# Altium schematic sheet AVR Board 4.0 Ports.SchDoc
size A
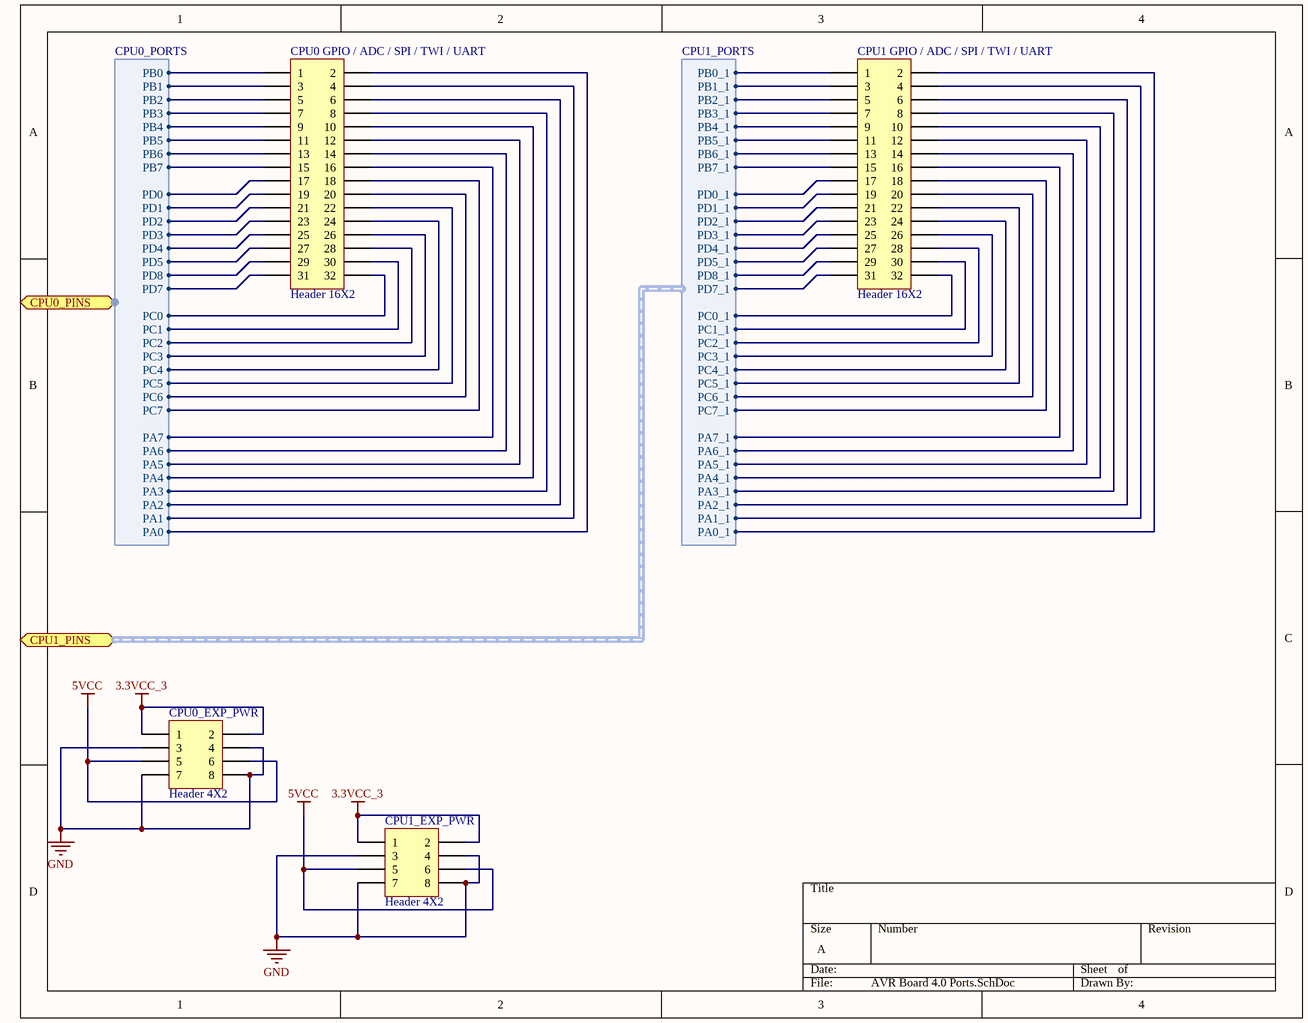
[diagram p0: AVR Board 4.0 Ports.SchDoc]

## Parts
CPU0_EXP_PWR  Header 4X2  [HDR2X4]
CPU0_GPIO_/_ADC_/_SPI_/_TWI_/_UART  Header 16X2  [HDR2X16]
CPU1_EXP_PWR  Header 4X2  [HDR2X4]
CPU1_GPIO_/_ADC_/_SPI_/_TWI_/_UART  Header 16X2  [HDR2X16]

## Ports
CPU0_PINS (harness CPU0_PORTS), CPU1_PINS (harness CPU1_PORTS)

## Harnesses
CPU0_PORTS: PA0, PA1, PA2, PA3, PA4, PA5, PA6, PA7, PC0, PC1, PC2, PC3, PC4, PC5, PC6, PC7, PD7, PD8, PD5, PD4, PD3, PD2, PD1, PD0, PB7, PB6, PB5, PB4, PB3, PB2, PB1, PB0
CPU1_PORTS: PA0_1, PA1_1, PA2_1, PA3_1, PA4_1, PA5_1, PA6_1, PA7_1, PC0_1, PC1_1, PC2_1, PC3_1, PC4_1, PC5_1, PC6_1, PC7_1, PD7_1, PD8_1, PD5_1, PD4_1, PD3_1, PD2_1, PD1_1, PD0_1, PB7_1, PB6_1, PB5_1, PB4_1, PB3_1, PB2_1, PB1_1, PB0_1

## Nets
3.3VCC_3: CPU0_EXP_PWR.1 CPU0_EXP_PWR.2 CPU1_EXP_PWR.1 CPU1_EXP_PWR.2
5VCC: CPU0_EXP_PWR.5 CPU0_EXP_PWR.6 CPU1_EXP_PWR.5 CPU1_EXP_PWR.6
GND: CPU0_EXP_PWR.3 CPU0_EXP_PWR.4 CPU0_EXP_PWR.7 CPU0_EXP_PWR.8 CPU1_EXP_PWR.3 CPU1_EXP_PWR.4 CPU1_EXP_PWR.7 CPU1_EXP_PWR.8
NetCPU0_GPIO_/_ADC_/_SPI_/_TWI_/_UART_1: CPU0_GPIO_/_ADC_/_SPI_/_TWI_/_UART.1 ; port CPU0_PINS.PB0
NetCPU0_GPIO_/_ADC_/_SPI_/_TWI_/_UART_2: CPU0_GPIO_/_ADC_/_SPI_/_TWI_/_UART.2 ; port CPU0_PINS.PA0
NetCPU0_GPIO_/_ADC_/_SPI_/_TWI_/_UART_3: CPU0_GPIO_/_ADC_/_SPI_/_TWI_/_UART.3 ; port CPU0_PINS.PB1
NetCPU0_GPIO_/_ADC_/_SPI_/_TWI_/_UART_4: CPU0_GPIO_/_ADC_/_SPI_/_TWI_/_UART.4 ; port CPU0_PINS.PA1
NetCPU0_GPIO_/_ADC_/_SPI_/_TWI_/_UART_5: CPU0_GPIO_/_ADC_/_SPI_/_TWI_/_UART.5 ; port CPU0_PINS.PB2
NetCPU0_GPIO_/_ADC_/_SPI_/_TWI_/_UART_6: CPU0_GPIO_/_ADC_/_SPI_/_TWI_/_UART.6 ; port CPU0_PINS.PA2
NetCPU0_GPIO_/_ADC_/_SPI_/_TWI_/_UART_7: CPU0_GPIO_/_ADC_/_SPI_/_TWI_/_UART.7 ; port CPU0_PINS.PB3
NetCPU0_GPIO_/_ADC_/_SPI_/_TWI_/_UART_8: CPU0_GPIO_/_ADC_/_SPI_/_TWI_/_UART.8 ; port CPU0_PINS.PA3
NetCPU0_GPIO_/_ADC_/_SPI_/_TWI_/_UART_9: CPU0_GPIO_/_ADC_/_SPI_/_TWI_/_UART.9 ; port CPU0_PINS.PB4
NetCPU0_GPIO_/_ADC_/_SPI_/_TWI_/_UART_10: CPU0_GPIO_/_ADC_/_SPI_/_TWI_/_UART.10 ; port CPU0_PINS.PA4
NetCPU0_GPIO_/_ADC_/_SPI_/_TWI_/_UART_11: CPU0_GPIO_/_ADC_/_SPI_/_TWI_/_UART.11 ; port CPU0_PINS.PB5
NetCPU0_GPIO_/_ADC_/_SPI_/_TWI_/_UART_12: CPU0_GPIO_/_ADC_/_SPI_/_TWI_/_UART.12 ; port CPU0_PINS.PA5
NetCPU0_GPIO_/_ADC_/_SPI_/_TWI_/_UART_13: CPU0_GPIO_/_ADC_/_SPI_/_TWI_/_UART.13 ; port CPU0_PINS.PB6
NetCPU0_GPIO_/_ADC_/_SPI_/_TWI_/_UART_14: CPU0_GPIO_/_ADC_/_SPI_/_TWI_/_UART.14 ; port CPU0_PINS.PA6
NetCPU0_GPIO_/_ADC_/_SPI_/_TWI_/_UART_15: CPU0_GPIO_/_ADC_/_SPI_/_TWI_/_UART.15 ; port CPU0_PINS.PB7
NetCPU0_GPIO_/_ADC_/_SPI_/_TWI_/_UART_16: CPU0_GPIO_/_ADC_/_SPI_/_TWI_/_UART.16 ; port CPU0_PINS.PA7
NetCPU0_GPIO_/_ADC_/_SPI_/_TWI_/_UART_17: CPU0_GPIO_/_ADC_/_SPI_/_TWI_/_UART.17 ; port CPU0_PINS.PD0
NetCPU0_GPIO_/_ADC_/_SPI_/_TWI_/_UART_18: CPU0_GPIO_/_ADC_/_SPI_/_TWI_/_UART.18 ; port CPU0_PINS.PC7
NetCPU0_GPIO_/_ADC_/_SPI_/_TWI_/_UART_19: CPU0_GPIO_/_ADC_/_SPI_/_TWI_/_UART.19 ; port CPU0_PINS.PD1
NetCPU0_GPIO_/_ADC_/_SPI_/_TWI_/_UART_20: CPU0_GPIO_/_ADC_/_SPI_/_TWI_/_UART.20 ; port CPU0_PINS.PC6
NetCPU0_GPIO_/_ADC_/_SPI_/_TWI_/_UART_21: CPU0_GPIO_/_ADC_/_SPI_/_TWI_/_UART.21 ; port CPU0_PINS.PD2
NetCPU0_GPIO_/_ADC_/_SPI_/_TWI_/_UART_22: CPU0_GPIO_/_ADC_/_SPI_/_TWI_/_UART.22 ; port CPU0_PINS.PC5
NetCPU0_GPIO_/_ADC_/_SPI_/_TWI_/_UART_23: CPU0_GPIO_/_ADC_/_SPI_/_TWI_/_UART.23 ; port CPU0_PINS.PD3
NetCPU0_GPIO_/_ADC_/_SPI_/_TWI_/_UART_24: CPU0_GPIO_/_ADC_/_SPI_/_TWI_/_UART.24 ; port CPU0_PINS.PC4
NetCPU0_GPIO_/_ADC_/_SPI_/_TWI_/_UART_25: CPU0_GPIO_/_ADC_/_SPI_/_TWI_/_UART.25 ; port CPU0_PINS.PD4
NetCPU0_GPIO_/_ADC_/_SPI_/_TWI_/_UART_26: CPU0_GPIO_/_ADC_/_SPI_/_TWI_/_UART.26 ; port CPU0_PINS.PC3
NetCPU0_GPIO_/_ADC_/_SPI_/_TWI_/_UART_27: CPU0_GPIO_/_ADC_/_SPI_/_TWI_/_UART.27 ; port CPU0_PINS.PD5
NetCPU0_GPIO_/_ADC_/_SPI_/_TWI_/_UART_28: CPU0_GPIO_/_ADC_/_SPI_/_TWI_/_UART.28 ; port CPU0_PINS.PC2
NetCPU0_GPIO_/_ADC_/_SPI_/_TWI_/_UART_29: CPU0_GPIO_/_ADC_/_SPI_/_TWI_/_UART.29 ; port CPU0_PINS.PD8
NetCPU0_GPIO_/_ADC_/_SPI_/_TWI_/_UART_30: CPU0_GPIO_/_ADC_/_SPI_/_TWI_/_UART.30 ; port CPU0_PINS.PC1
NetCPU0_GPIO_/_ADC_/_SPI_/_TWI_/_UART_31: CPU0_GPIO_/_ADC_/_SPI_/_TWI_/_UART.31 ; port CPU0_PINS.PD7
NetCPU0_GPIO_/_ADC_/_SPI_/_TWI_/_UART_32: CPU0_GPIO_/_ADC_/_SPI_/_TWI_/_UART.32 ; port CPU0_PINS.PC0
NetCPU1_GPIO_/_ADC_/_SPI_/_TWI_/_UART_1: CPU1_GPIO_/_ADC_/_SPI_/_TWI_/_UART.1 ; port CPU1_PINS.PB0_1
NetCPU1_GPIO_/_ADC_/_SPI_/_TWI_/_UART_2: CPU1_GPIO_/_ADC_/_SPI_/_TWI_/_UART.2 ; port CPU1_PINS.PA0_1
NetCPU1_GPIO_/_ADC_/_SPI_/_TWI_/_UART_3: CPU1_GPIO_/_ADC_/_SPI_/_TWI_/_UART.3 ; port CPU1_PINS.PB1_1
NetCPU1_GPIO_/_ADC_/_SPI_/_TWI_/_UART_4: CPU1_GPIO_/_ADC_/_SPI_/_TWI_/_UART.4 ; port CPU1_PINS.PA1_1
NetCPU1_GPIO_/_ADC_/_SPI_/_TWI_/_UART_5: CPU1_GPIO_/_ADC_/_SPI_/_TWI_/_UART.5 ; port CPU1_PINS.PB2_1
NetCPU1_GPIO_/_ADC_/_SPI_/_TWI_/_UART_6: CPU1_GPIO_/_ADC_/_SPI_/_TWI_/_UART.6 ; port CPU1_PINS.PA2_1
NetCPU1_GPIO_/_ADC_/_SPI_/_TWI_/_UART_7: CPU1_GPIO_/_ADC_/_SPI_/_TWI_/_UART.7 ; port CPU1_PINS.PB3_1
NetCPU1_GPIO_/_ADC_/_SPI_/_TWI_/_UART_8: CPU1_GPIO_/_ADC_/_SPI_/_TWI_/_UART.8 ; port CPU1_PINS.PA3_1
NetCPU1_GPIO_/_ADC_/_SPI_/_TWI_/_UART_9: CPU1_GPIO_/_ADC_/_SPI_/_TWI_/_UART.9 ; port CPU1_PINS.PB4_1
NetCPU1_GPIO_/_ADC_/_SPI_/_TWI_/_UART_10: CPU1_GPIO_/_ADC_/_SPI_/_TWI_/_UART.10 ; port CPU1_PINS.PA4_1
NetCPU1_GPIO_/_ADC_/_SPI_/_TWI_/_UART_11: CPU1_GPIO_/_ADC_/_SPI_/_TWI_/_UART.11 ; port CPU1_PINS.PB5_1
NetCPU1_GPIO_/_ADC_/_SPI_/_TWI_/_UART_12: CPU1_GPIO_/_ADC_/_SPI_/_TWI_/_UART.12 ; port CPU1_PINS.PA5_1
NetCPU1_GPIO_/_ADC_/_SPI_/_TWI_/_UART_13: CPU1_GPIO_/_ADC_/_SPI_/_TWI_/_UART.13 ; port CPU1_PINS.PB6_1
NetCPU1_GPIO_/_ADC_/_SPI_/_TWI_/_UART_14: CPU1_GPIO_/_ADC_/_SPI_/_TWI_/_UART.14 ; port CPU1_PINS.PA6_1
NetCPU1_GPIO_/_ADC_/_SPI_/_TWI_/_UART_15: CPU1_GPIO_/_ADC_/_SPI_/_TWI_/_UART.15 ; port CPU1_PINS.PB7_1
NetCPU1_GPIO_/_ADC_/_SPI_/_TWI_/_UART_16: CPU1_GPIO_/_ADC_/_SPI_/_TWI_/_UART.16 ; port CPU1_PINS.PA7_1
NetCPU1_GPIO_/_ADC_/_SPI_/_TWI_/_UART_17: CPU1_GPIO_/_ADC_/_SPI_/_TWI_/_UART.17 ; port CPU1_PINS.PD0_1
NetCPU1_GPIO_/_ADC_/_SPI_/_TWI_/_UART_18: CPU1_GPIO_/_ADC_/_SPI_/_TWI_/_UART.18 ; port CPU1_PINS.PC7_1
NetCPU1_GPIO_/_ADC_/_SPI_/_TWI_/_UART_19: CPU1_GPIO_/_ADC_/_SPI_/_TWI_/_UART.19 ; port CPU1_PINS.PD1_1
NetCPU1_GPIO_/_ADC_/_SPI_/_TWI_/_UART_20: CPU1_GPIO_/_ADC_/_SPI_/_TWI_/_UART.20 ; port CPU1_PINS.PC6_1
NetCPU1_GPIO_/_ADC_/_SPI_/_TWI_/_UART_21: CPU1_GPIO_/_ADC_/_SPI_/_TWI_/_UART.21 ; port CPU1_PINS.PD2_1
NetCPU1_GPIO_/_ADC_/_SPI_/_TWI_/_UART_22: CPU1_GPIO_/_ADC_/_SPI_/_TWI_/_UART.22 ; port CPU1_PINS.PC5_1
NetCPU1_GPIO_/_ADC_/_SPI_/_TWI_/_UART_23: CPU1_GPIO_/_ADC_/_SPI_/_TWI_/_UART.23 ; port CPU1_PINS.PD3_1
NetCPU1_GPIO_/_ADC_/_SPI_/_TWI_/_UART_24: CPU1_GPIO_/_ADC_/_SPI_/_TWI_/_UART.24 ; port CPU1_PINS.PC4_1
NetCPU1_GPIO_/_ADC_/_SPI_/_TWI_/_UART_25: CPU1_GPIO_/_ADC_/_SPI_/_TWI_/_UART.25 ; port CPU1_PINS.PD4_1
NetCPU1_GPIO_/_ADC_/_SPI_/_TWI_/_UART_26: CPU1_GPIO_/_ADC_/_SPI_/_TWI_/_UART.26 ; port CPU1_PINS.PC3_1
NetCPU1_GPIO_/_ADC_/_SPI_/_TWI_/_UART_27: CPU1_GPIO_/_ADC_/_SPI_/_TWI_/_UART.27 ; port CPU1_PINS.PD5_1
NetCPU1_GPIO_/_ADC_/_SPI_/_TWI_/_UART_28: CPU1_GPIO_/_ADC_/_SPI_/_TWI_/_UART.28 ; port CPU1_PINS.PC2_1
NetCPU1_GPIO_/_ADC_/_SPI_/_TWI_/_UART_29: CPU1_GPIO_/_ADC_/_SPI_/_TWI_/_UART.29 ; port CPU1_PINS.PD8_1
NetCPU1_GPIO_/_ADC_/_SPI_/_TWI_/_UART_30: CPU1_GPIO_/_ADC_/_SPI_/_TWI_/_UART.30 ; port CPU1_PINS.PC1_1
NetCPU1_GPIO_/_ADC_/_SPI_/_TWI_/_UART_31: CPU1_GPIO_/_ADC_/_SPI_/_TWI_/_UART.31 ; port CPU1_PINS.PD7_1
NetCPU1_GPIO_/_ADC_/_SPI_/_TWI_/_UART_32: CPU1_GPIO_/_ADC_/_SPI_/_TWI_/_UART.32 ; port CPU1_PINS.PC0_1

## Library data of the parts
CPU0_EXP_PWR CPU1_EXP_PWR = Header 4X2: Header, 4-Pin, Dual row; LatestRevisionDate: 17-Jul-2002; LatestRevisionNote: Re-released for DXP Platform.; Publisher: Altium Limited
CPU0_GPIO_/_ADC_/_SPI_/_TWI_/_UART CPU1_GPIO_/_ADC_/_SPI_/_TWI_/_UART = Header 16X2: Header, 16-Pin, Dual row; LatestRevisionDate: 17-Jul-2002; LatestRevisionNote: Re-released for DXP Platform.; Publisher: Altium Limited